# EAGLE design Weather Shield (EAGLE 6.5.0)
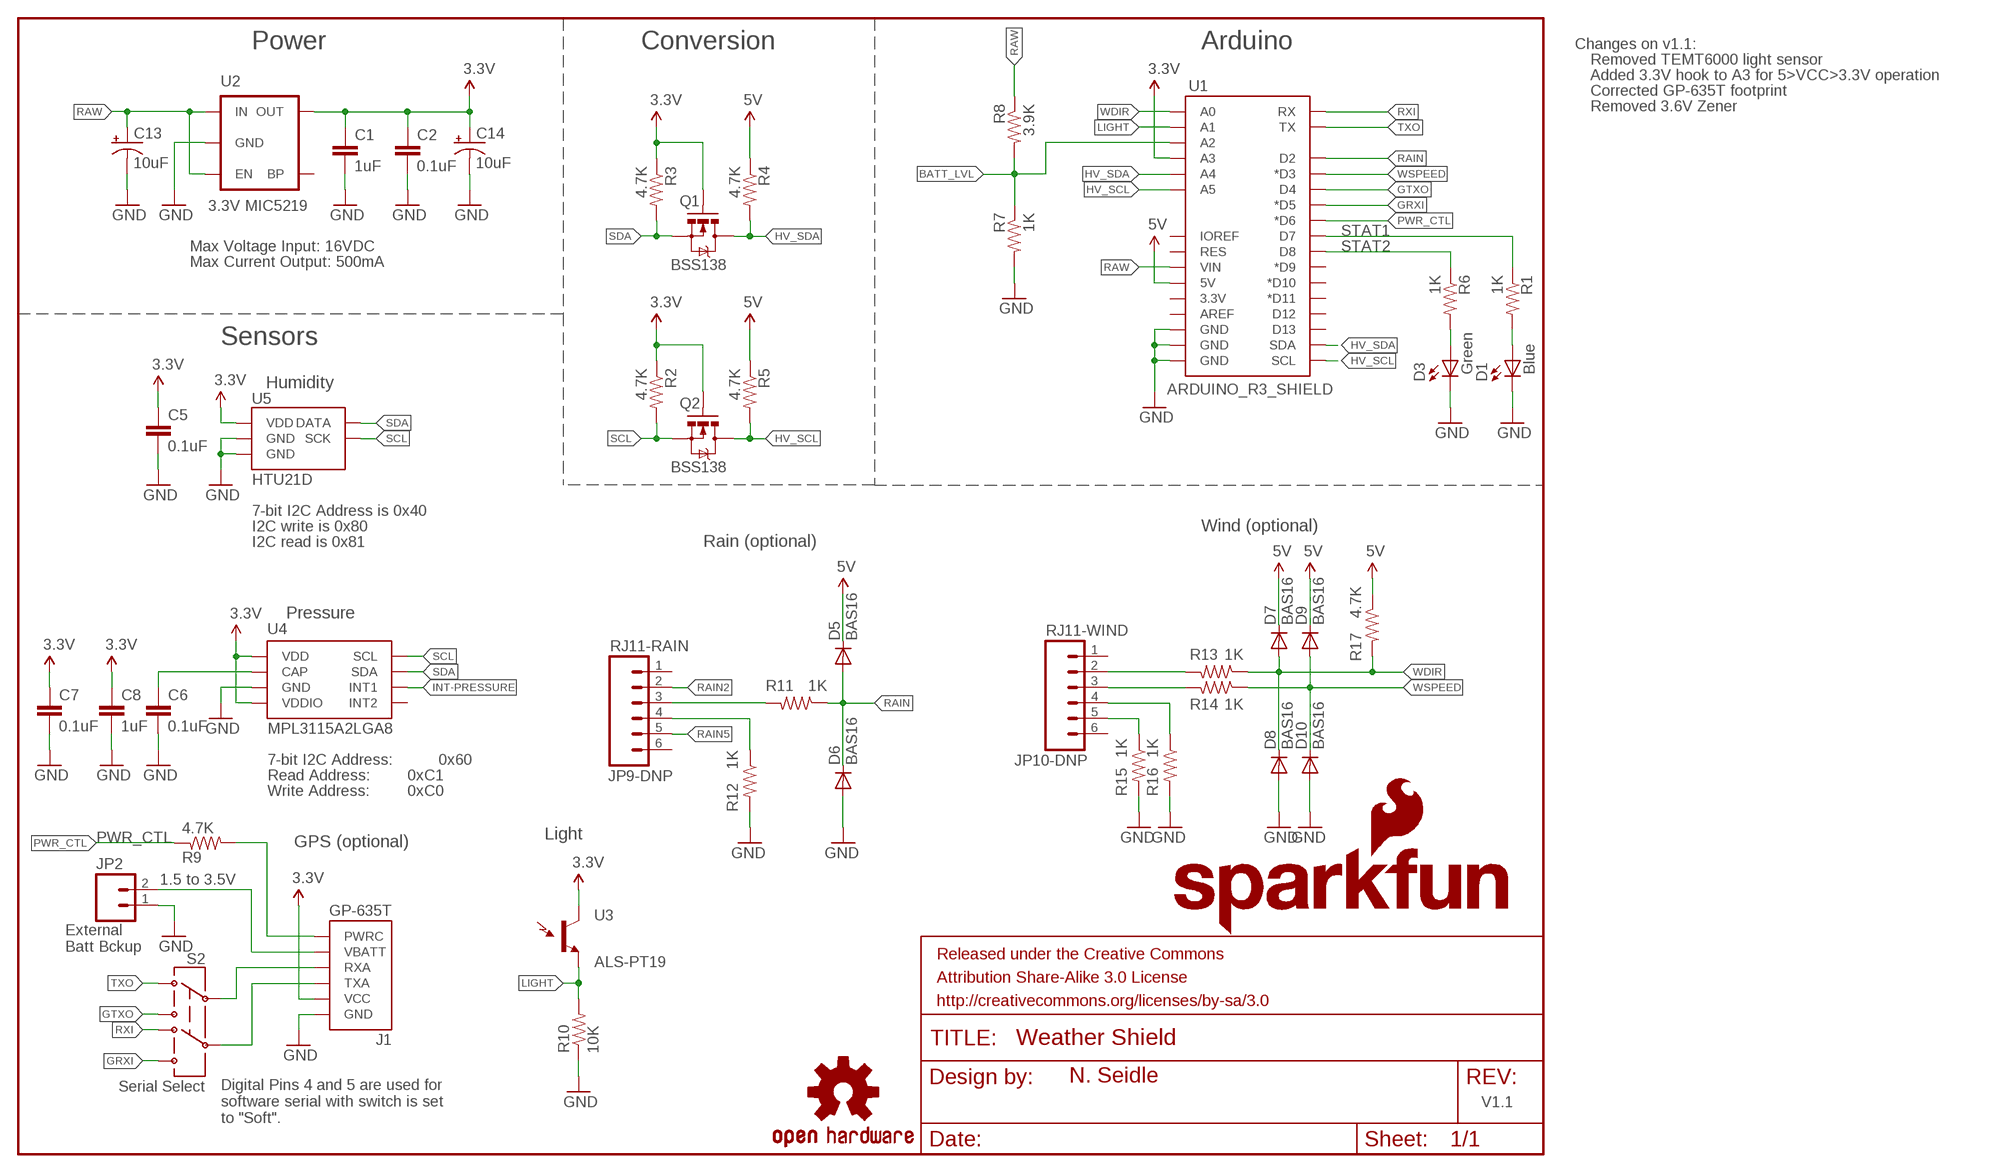
[diagram p0: schematic, sheet 1]

## Parts
C1  1uF  CAP0603-CAP  [0603-CAP]
C2  0.1uF  CAP0603-CAP  [0603-CAP]
C5  0.1uF  CAP0603-CAP  [0603-CAP]
C6  0.1uF  CAP0603-CAP  [0603-CAP]
C7  0.1uF  CAP0603-CAP  [0603-CAP]
C8  1uF  CAP0603-CAP  [0603-CAP]
C13  10uF  CAP_POL1206  [EIA3216]
C14  10uF  CAP_POL1206  [EIA3216]
D1  Blue  LED0603  [LED-0603]
D3  Green  LED0603  [LED-0603]
D5  BAS16  DIODESOD  [SOD-323]
D6  BAS16  DIODESOD  [SOD-323]
D7  BAS16  DIODESOD  [SOD-323]
D8  BAS16  DIODESOD  [SOD-323]
D9  BAS16  DIODESOD  [SOD-323]
D10  BAS16  DIODESOD  [SOD-323]
FRAME1  FRAME-LETTER  [CREATIVE_COMMONS]
J1  GP-635T  GP-635TSMD  [GP-635T]
JP2  External Batt Bckup  M02PTH  [1X02]
JP9-DNP  RJ11-RAIN  RJ11-6PTH  [RJ11-6]
JP10-DNP  RJ11-WIND  RJ11-6PTH  [RJ11-6]
LOGO1  OSHW-LOGOM  [OSHW-LOGO-M]
LOGO2  SFE_LOGO_NAME_FLAME.1_INCH  [SFE_LOGO_NAME_FLAME_.1]
Q1  BSS138  MOSFET-NCHANNELSMD  [SOT23-3]
Q2  BSS138  MOSFET-NCHANNELSMD  [SOT23-3]
R1  1K  RESISTOR0603-RES  [0603-RES]
R2  4.7K  RESISTOR0603-RES  [0603-RES]
R3  4.7K  RESISTOR0603-RES  [0603-RES]
R4  4.7K  RESISTOR0603-RES  [0603-RES]
R5  4.7K  RESISTOR0603-RES  [0603-RES]
R6  1K  RESISTOR0603-RES  [0603-RES]
R7  1K  RESISTOR0603-RES  [0603-RES]
R8  3.9K  RESISTOR0603-RES  [0603-RES]
R9  4.7K  RESISTOR0603-RES  [0603-RES]
R10  10K  RESISTOR0603-RES  [0603-RES]
R11  1K  RESISTOR0603-RES  [0603-RES]
R12  1K  RESISTOR0603-RES  [0603-RES]
R13  1K  RESISTOR0603-RES  [0603-RES]
R14  1K  RESISTOR0603-RES  [0603-RES]
R15  1K  RESISTOR0603-RES  [0603-RES]
R16  1K  RESISTOR0603-RES  [0603-RES]
R17  4.7K  RESISTOR0603-RES  [0603-RES]
S2  Serial Select  SWITCH-DPDTAYZ0202  [AYZ0202]
U1  ARDUINO_R3_SHIELD  [UNO_R3_SHIELD]
U2  3.3V MIC5219  V_REG_LDOSMD  [SOT23-5]
U3  ALS-PT19  LIGHTSENSORALS  [ALS-PT19]
U4  MPL3115A2LGA8  [LGA8]
U5  HTU21D  HTU21DSMD  [HTU21D]

## Nets
3.3V: C1.1 C2.1 C5.1 C7.1 C8.1 C14.A(+) J1.2(VCC) Q1.1(G) Q2.1(G) R2.1 R3.1 U1.A3 U2.5(OUT) U3.C(C1) U4.1(VDD) U4.4(VDDIO) U5.VDD
3V_PWR_CTL: J1.6(PWRC) R9.2
5V: D5.1(C) D7.1(C) D9.1(C) R4.1 R5.1 R17.1 U1.5V
BATT_LVL: R7.1 R8.2 U1.A2
GND [vcc]: C1.2 C2.2 C5.2 C6.2 C7.2 C8.2 C13.C(-) C14.C(-) D1.C D3.C D6.2(A) D8.2(A) D10.2(A) J1.1(GND) JP2.1 R7.2 R10.1 R12.2 R15.2 R16.2 U1.GND@0(GND) U1.GND@1(GND) U1.GND@2(GND) U2.2(GND) U4.3(GND) U5.7(GND) U5.GND
GPS-RX: J1.4(RXA) S2.2
GPS-TX: J1.3(TXA) S2.5
GRXI: S2.6 U1.D5(*D5)
GTXO: S2.3 U1.D4
HV_SCL: Q2.3(D) R5.2 U1.A5 U1.SCL
HV_SDA: Q1.3(D) R4.2 U1.A4 U1.SDA
INT-PRESSURE: U4.6(INT1)
LIGHT: R10.2 U1.A1 U3.E(E1)
N$1: JP10-DNP.3 R14.2
N$2: JP10-DNP.2 R13.2
N$3: D1.A R1.2
N$4: JP9-DNP.3 R11.2
N$5: C6.1 U4.2(CAP)
N$7: D3.A R6.2
N$11: JP9-DNP.4 R12.1
N$12: JP10-DNP.5 R15.1
N$13: JP10-DNP.4 R16.1
PWR_CTL: R9.1 U1.D6(*D6)
RAIN: D5.2(A) D6.1(C) R11.1 U1.D2
RAIN2: JP9-DNP.2
RAIN5: JP9-DNP.5
RAW [vcc]: C13.A(+) R8.1 U1.VIN U2.1(IN) U2.3(EN)
RXI: S2.4 U1.RX
SCL: Q2.2(S) R2.2 U4.8(SCL) U5.SCK
SDA: Q1.2(S) R3.2 U4.7(SDA) U5.DATA
STAT1: R1.1 U1.D7
STAT2: R6.1 U1.D8
TXO: S2.1 U1.TX
V_BATT: J1.5(VBATT) JP2.2
WDIR: D7.2(A) D8.1(C) R13.1 R17.2 U1.A0
WSPEED: D9.2(A) D10.1(C) R14.1 U1.D3(*D3)
Unconnected: JP9-DNP.1 JP9-DNP.6 JP10-DNP.1 JP10-DNP.6 U1.3.3V U1.AREF U1.D9(*D9) U1.D10(*D10) U1.D11(*D11) U1.D12 U1.D13 U1.IOREF U1.RES U2.4(BP) U4.5(INT2)

## Notes on the sheet
- Power | Conversion | Arduino | Changes on v1.1:
- Removed TEMT6000 light sensor
- Added 3.3V hook to A3 for 5>VCC>3.3V operation
- Corrected GP-635T footprint
- Removed 3.6V Zener
- Max Voltage Input: 16VDC
- Max Current Output: 500mA
- Sensors
- Humidity
- 7-bit I2C Address is 0x40
- I2C write is 0x80 | Wind (optional)
- I2C read is 0x81 | Rain (optional)
- Pressure
- 7-bit I2C Address: | 0x60
- Read Address: | 0xC1
- Write Address: | 0xC0
- Light
- GPS (optional)
- 1.5 to 3.5V
- External
  Batt Bckup
- N. Seidle
- V1.1
- Digital Pins 4 and 5 are used for 
  software serial with switch is set
  to "Soft".

## Library data of the parts
C1 C2 C5-C8 = SparkFun:CAP: Capacitor Standard 0603 ceramic capacitor, and 0.1" leaded capacitor.
C13 C14 = SparkFun-Passives:CAP_POL: Capacitor Polarized These are standard SMD and PTH capacitors. Normally 10uF, 47uF, and 100uF in electrolytic and tantalum varieties. Always verify the external diameter of the through hole cap, it varies with capacity, voltage, and manufacturer. The EIA devices should be standard.
D1 D3 = SparkFun:LED: LEDs Standard schematic elements and footprints for 5mm, 3mm, 1206, and 0603 sized LEDs. 5mm - Spark Fun Electronics SKU : COM-00529 (and others)
D5-D10 = SparkFun:DIODE: Diode These are standard reverse protection diodes and small signal diodes. SMA package can handle up to about 1A. SOD-323 can handle about 200mA. What the SOD-323 package when ordering, there are some mfgs out there that are 5-pin packages.
FRAME1 = SparkFun-Aesthetics:FRAME-LETTER: Schematic Frame Standard 8.5x11 US Letter frame
J1 = SparkFun-Sensors:GP-635T: Description: Footprint and symbol for the GP-635T GPS module. This is a very small, very accurate, low-cost GPS receiver. Footprint works with SKU GPS-00579. Use cable GPS-00574 or GPS-09123 to connect the receiver to this footprint+connector.
JP2 = SparkFun-Connectors:M02: Standard 2-pin 0.1" header. Use with - straight break away headers ( PRT-00116) - right angle break away headers (PRT-00553) - swiss pins (PRT-00743) - machine pins (PRT-00117) - female headers (PRT-00115) Molex polarized connector foot print use with: PRT-08233 with associated crimp pins and housings. 2.54_SCREWTERM for use with PRT-10571. 3.5mm Screw Terminal footprints for PRT-08084 5mm Screw Terminal footprints for use with PRT-08433
JP9-DNP JP10-DNP = SparkFun:RJ11-6: RJ11 Jack Simple 6 pin RJ11 jack. Commonly found on CAT3 devices and Microchip programmers. SKU: PRT-00132
LOGO1 = SparkFun-Aesthetics:OSHW-LOGO: Open Source Hardware Logo This logo indicates the piece of hardware it is found on incorporates a OSHW license and/or adheres to the definition of open source hardware found here: http://freedomdefined.org/OSHW
LOGO2 = SparkFun-Aesthetics:SFE_LOGO_NAME_FLAME: SFE Logo, name and flame This is the SparkFun full logo. The logo on the schematic will always be the same size; the package variant is the height of the flame part of the logo. Default layer for the logo on the board is tSilk.
Q1 Q2 = SparkFun:MOSFET-NCHANNEL
R1-R9 R11-R17 = SparkFun:RESISTOR: Resistor Basic schematic elements and footprints for 0603, 1206, and PTH resistors.
R10 = SparkFun-Passives:RESISTOR: Resistor Basic schematic elements and footprints for 0603, 1206, and PTH resistors.
S2 = SparkFun-Electromechanical:SWITCH-DPDT: DPDT Version of the COM-00597; PROD_ID: SWCH-08179; VALUE: DPDT
U1 = SparkFun-Boards:ARDUINO_R3_SHIELD: Shield form compatible with the Arduino Uno R3.
U2 = SparkFun:V_REG_LDO: Voltage Regulator LDO Standard 150mA LDO voltage regulator in SOT-23 layout. Micrel part MIC5205. BP (by-pass) pin is used to lower output noise with 470pF cap.
U3 = SparkFun-Sensors:LIGHTSENSOR: Ambient Light Sensor Simple light detection sensor. Output varies with light intensity input. Spark Fun Electronics SKU : COM-08348
U4 = SparkFun-Sensors:MPL3115A2: Altimeter/Pressure Sensor, I2C, 1.95V-3.6V supply, 50 to 110kPa
U5 = SparkFun-Sensors:HTU21D

## Net classes
0 Default: width 0.203 mm
1 vcc: width 0.203 mm

## Board
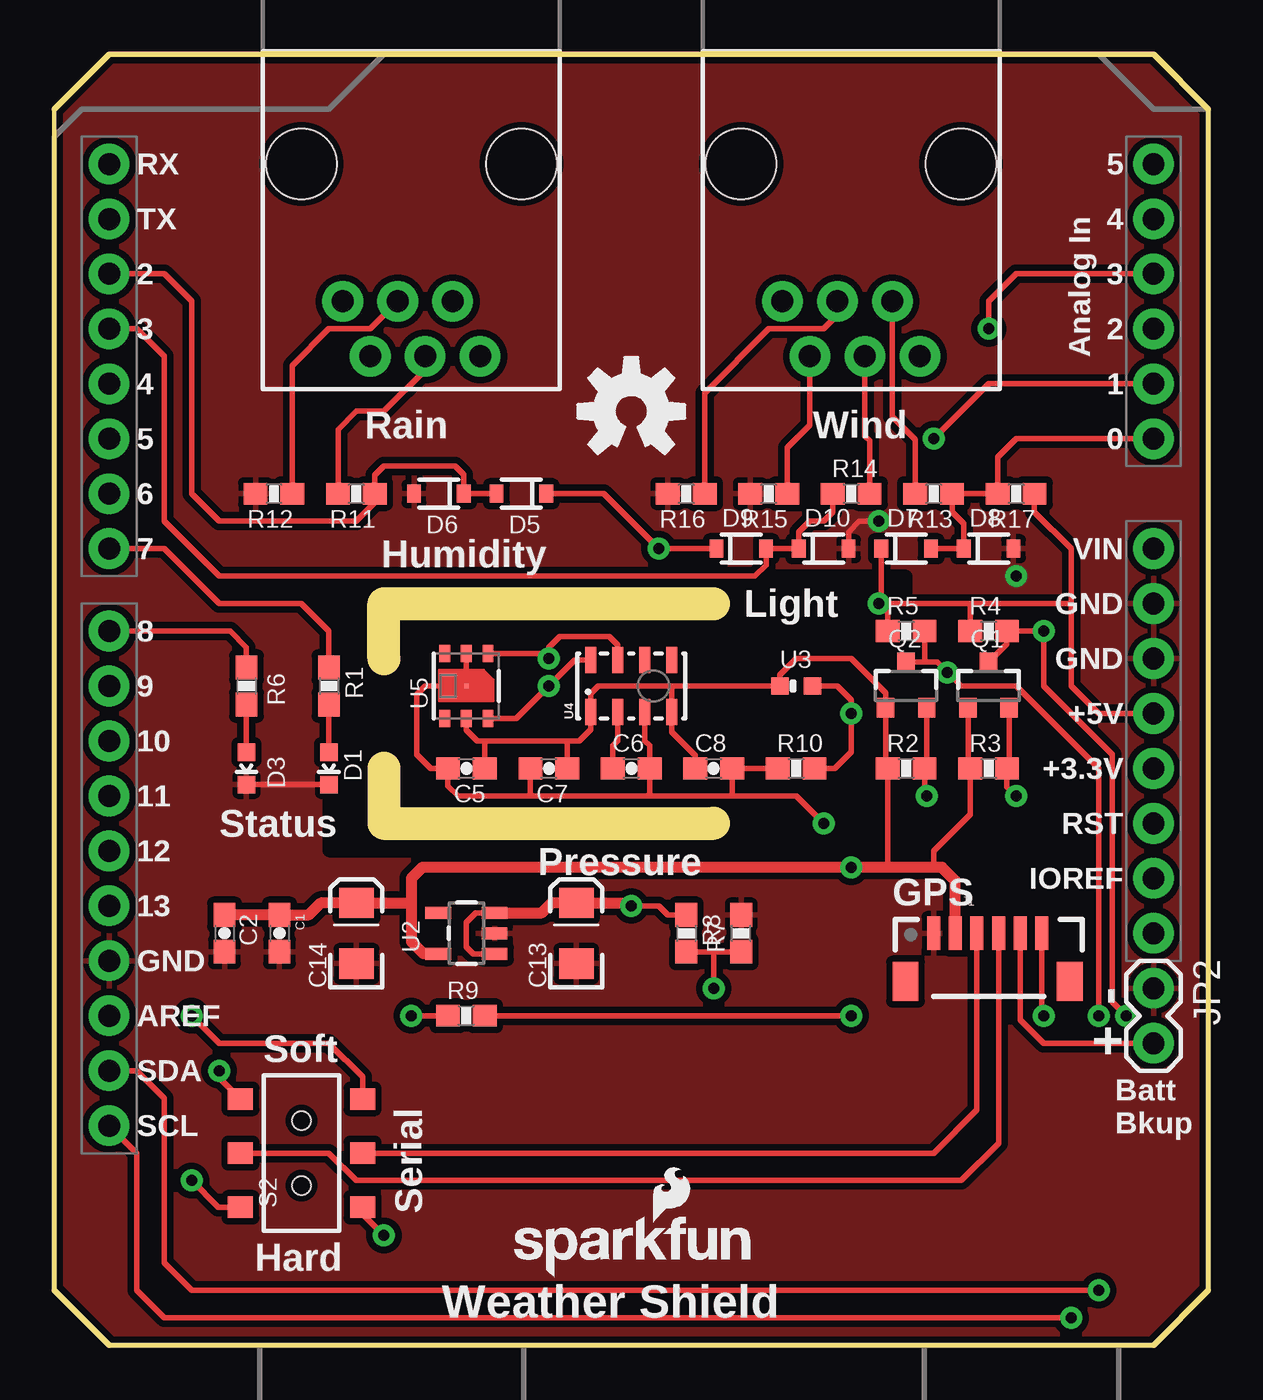
[diagram p1: board, top side]
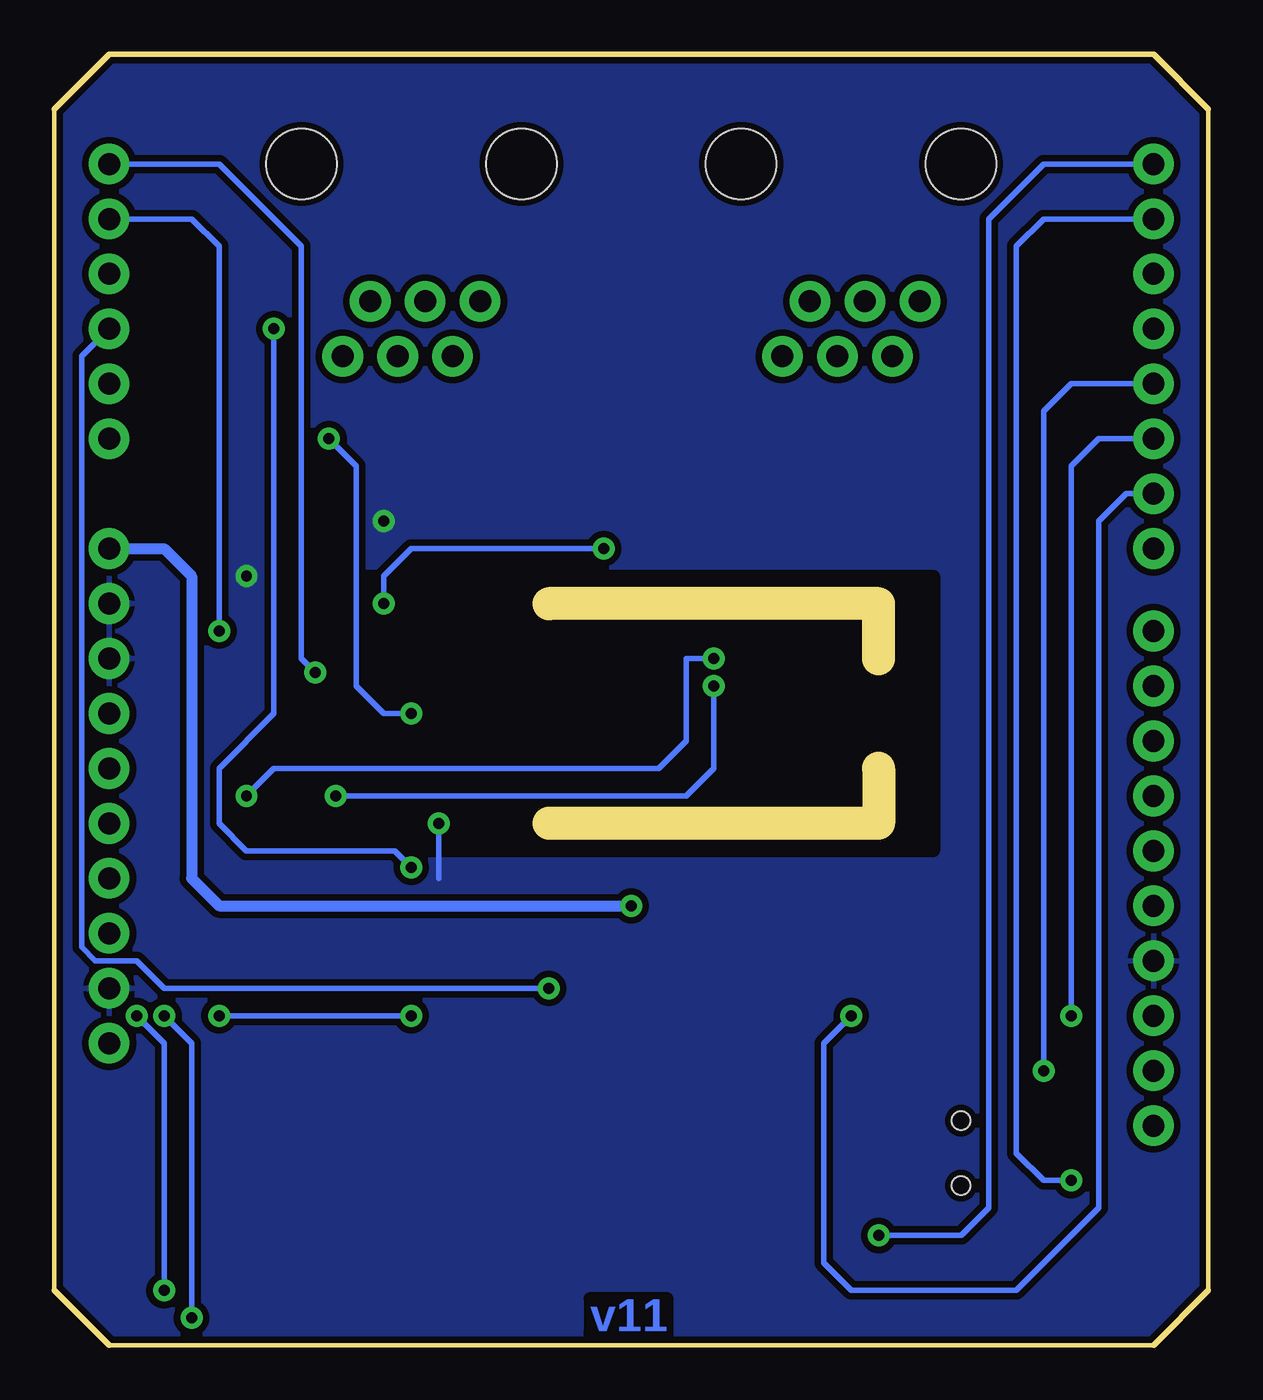
[diagram p2: board, bottom side, seen from below]

Size 53.34 x 59.69 mm. Coordinates in mm from the lower left corner, seen from the top.
Outline: 53.34,2.54 53.34,57.15 50.8,59.69 2.54,59.69 0,57.15 0,2.54 2.54,0 50.8,0 53.34,2.54
Copper layers (1*16): Top 0.035mm / dielectric 1.5mm / Bottom 0.035mm
Design rules "SparkFun": minimum track width 8mil, minimum drill 20mil, track to track 8mil, track to pad 8mil, pad to pad 8mil, via to via 8mil, smd to smd 8mil, copper to edge 10mil, drill to drill 8mil, minimum pad ring 12mil, minimum via ring 10mil, stop-mask expansion 4mil, vias tented up to drill 20mil, thermal gap 10mil
tRestrict: area 12.7,22.9 to 39.4,35.6
bRestrict: area 12.7,22.9 to 39.4,35.6
Milling: 4 lines

### Footprints (pad centres in the part's own frame; a part is rotated, then mirrored left to right if it is on the bottom)
0603-CAP = smd 1.1 x 1: 1 -0.85,0; 2 0.85,0
EIA3216 = smd 1.4 x 1.6: A 1.4,0; C -1.4,0
LED-0603 = smd 0.8 x 0.8: A 0,-0.75; C 0,0.75
SOD-323 = smd 0.63 x 0.83: 1 -1.15,0; 2 1.15,0
GP-635T = smd 0.6 x 1.55: 1 -2.54,1.27; 2 -1.54,1.27; 3 -0.54,1.27; 4 0.46,1.27; 5 1.46,1.27; 6 2.46,1.27 | smd 1.2 x 1.8: P$1 -3.84,-0.955; P$2 3.76,-0.955
1X02 = drill 1.016 pad 1.88: 1 0,0; 2 2.54,0
RJ11-6 = drill 1.016 pad 1.88: 1 1.905,8.89; 2 3.175,6.35; 3 4.445,8.89; 4 5.715,6.35; 5 6.985,8.89; 6 8.255,6.35 | hole 3.251: 0,0; 10.16,0
SOT23-3 = smd 0.8 x 0.9: 1 -0.95,-1; 2 0.95,-1; 3 0,1.1
0603-RES = smd 1.1 x 1: 1 -0.85,0; 2 0.85,0
AYZ0202 = smd 1 x 1.15: 1 -2.5,2.825; 2 0,2.825; 3 2.5,2.825; 4 -2.5,-2.825; 5 0,-2.825; 6 2.5,-2.825 | hole 0.85: 1.5,0; -1.5,0
UNO_R3_SHIELD = drill 1.016 pad 1.88: 3.3V 50.8,26.67; 5V 50.8,29.21; A0 50.8,41.91; A1 50.8,44.45; A2 50.8,46.99; A3 50.8,49.53; A4 50.8,52.07; A5 50.8,54.61; AREF 2.54,15.24; D2 2.54,49.53; D3 2.54,46.99; D4 2.54,44.45; D5 2.54,41.91; D6 2.54,39.37; D7 2.54,36.83; D8 2.54,33.02; D9 2.54,30.48; D10 2.54,27.94; D11 2.54,25.4; D12 2.54,22.86; D13 2.54,20.32; GND@0 50.8,31.75; GND@1 50.8,34.29; GND@2 2.54,17.78; IOREF 50.8,21.59; NC 50.8,19.05; RES 50.8,24.13; RX 2.54,54.61; SCL 2.54,10.16; SDA 2.54,12.7; TX 2.54,52.07; VIN 50.8,36.83
SOT23-5 = smd 0.55 x 1.2: 1 -0.95,-1.3; 2 0,-1.3; 3 0.95,-1.3; 4 0.95,1.3; 5 -0.95,1.3
ALS-PT19 = smd 0.8 x 0.8: C -0.75,0; E 0.75,0
LGA8 = smd 1.2 x 0.5: 1 -1.2,1.875; 2 -1.2,0.625; 3 -1.2,-0.625; 4 -1.2,-1.875; 5 1.2,-1.875; 6 1.2,-0.625; 7 1.2,0.625; 8 1.2,1.875
HTU21D = smd 0.2 x 0.2: 7 0,0 | smd 0.8 x 0.5: DATA 1.5,-1; GND 1.5,0; NC@1 -1.5,1; NC@6 1.5,1; SCK -1.5,-1; VDD -1.5,0

### Placement (x,y rotation side)
C1  10.41,19.05 270 top
C2  7.87,19.05 270 top
C5  19.05,26.67 180 top
C6  26.67,26.67 0 top
C7  22.86,26.67 180 top
C8  30.48,26.67 0 top
C13  24.13,19.05 90 top
C14  13.97,19.05 90 top
D1  12.7,26.67 180 top
D3  8.89,26.67 180 top
D5  21.59,39.37 180 top
D6  17.78,39.37 180 top
D7  39.37,36.83 0 top
D8  43.18,36.83 0 top
D9  31.75,36.83 0 top
D10  35.56,36.83 0 top
FRAME1  -8.89,-24.13 0 top  (outside the outline)
J1  43.18,17.78 0 top
JP2  50.8,16.51 270 top
JP9-DNP  21.59,54.61 180 top
JP10-DNP  41.91,54.61 180 top
LOGO1  26.67,43.18 0 top
LOGO2  20.83,3.05 0 top
Q1  43.18,30.48 0 top
Q2  39.37,30.48 0 top
R1  12.7,30.48 270 top
R2  39.37,26.67 0 top
R3  43.18,26.67 0 top
R4  43.18,33.02 0 top
R5  39.37,33.02 0 top
R6  8.89,30.48 270 top
R7  31.75,19.05 90 top
R8  29.21,19.05 270 top
R9  19.05,15.24 0 top
R10  34.29,26.67 0 top
R11  13.97,39.37 180 top
R12  10.16,39.37 180 top
R13  40.64,39.37 180 top
R14  36.83,39.37 0 top
R15  33.02,39.37 180 top
R16  29.21,39.37 180 top
R17  44.45,39.37 180 top
S2  11.43,8.89 90 top
U1  0,0 0 top
U2  19.05,19.05 90 top
U3  34.29,30.48 0 top
U4  26.67,30.48 90 top
U5  19.05,30.48 90 top

### Tracks (layer width: path | path; a pad name or v marks a point on that pad's centre or on a via)
3.3V  (via drill 0.51)
  Top 0.254: C7.1 23.71,27.9 | C8.1 29.63,27.27 28.55,28.35 U4.4 28.55,30.45 28.57,30.48 | 28.57,30.48 25.15,30.48 24.8,30.13 U4.1 24.8,28.48 24.26,27.94 23.75,27.94 23.71,27.9 | 28.57,30.48 U3.C 33.54,31 34.29,31.75 36.83,31.75 38.42,30.16 Q2.1 38.42,26.77 R2.1 38.52,22.31 38.73,22.1 | U1.A3 44.45,49.53 43.18,48.26 v43.18,46.99 | 18.2,22.14 18.16,22.1 | 40.64,22.1 40.64,22.86 42.33,24.55 R3.1 42.23,26.77 Q1.1 | U5.VDD 19.05,28.45 19.56,27.94 19.94,27.94 | 19.94,27.94 23.67,27.94 23.71,27.9 | C5.1 19.9,27.9 19.94,27.94
  Top 0.508: C2.1 C1.1 11.77,19.9 12.32,20.45 C14.A 16.38,20.45 16.51,20.32 | J1.2 41.64,21.48 41.02,22.1 40.64,22.1 38.73,22.1 v36.83,22.1 18.16,22.1 17.02,22.1 16.51,21.59 16.51,20.32 | 16.51,20.32 16.51,18.67 17.08,18.1 U2.5
  Bottom 0.254: v43.18,46.99 43.18,29.21 45.72,26.67 45.72,24.13 44.45,22.86 37.59,22.86 v36.83,22.1
3V_PWR_CTL  (via drill 0.51)
  Top 0.254: J1.6 45.64,15.32 v45.72,15.24 | R9.2 v36.83,15.24
  Bottom 0.254: v36.83,15.24 v45.72,15.24
5V  (via drill 0.51)
  Top 0.254: 42.33,32.98 R4.1 42.33,34.2 42.42,34.29 | D9.1 v27.94,36.83 25.4,39.37 D5.1 | 46.99,34.29 42.42,34.29 | 42.42,34.29 v38.1,34.29 | R17.1 45.3,38.52 46.99,36.83 46.99,34.29 | 46.99,34.29 46.99,30.48 48.26,29.21 U1.5V | D7.1 38.22,34.41 v38.1,34.29 | R5.1 38.52,33.87 v38.1,34.29
  Bottom 0.254: v27.94,36.83 36.83,36.83 38.1,35.56 v38.1,34.29
BATT_LVL  (via drill 0.51)
  Top 0.254: v30.48,16.51 30.48,18.2 | 30.48,18.2 R7.1 | 30.48,18.2 R8.2
  Bottom 0.254: U1.A2 52.07,45.72 52.07,18.41 51.44,17.78 49.53,17.78 48.26,16.51 v30.48,16.51
GND  (via drill 0.51)
  Top 0.254: U4.3 27.3,27.95 27.52,27.73 C6.2 27.52,25.49 27.43,25.4 | U5.GND U5.7 17.14,30.48 16.76,30.1 16.76,27.3 17.4,26.67 C5.2 18.2,25.87 18.67,25.4 22.1,25.4 | D10.2 36.71,37.6 37.21,38.1 v38.1,38.1 | 31.33,25.4 C8.2 R10.1 | D1.C D3.C | 22.1,25.4 27.43,25.4 | 27.43,25.4 31.33,25.4 | C7.2 22.01,25.49 22.1,25.4 | 31.33,25.4 34.29,25.4 v35.56,24.13
  Bottom 0.254: v35.56,24.13 35.56,21.59
  other vias: 44.45,35.56
  pour Top (isolate 0.305): 53.34,0 0,0 0,59.69 53.34,59.69
  pour Bottom (isolate 0.305): 53.34,0 0,0 0,59.69 53.34,59.69
GPS-RX
  Top 0.254: S2.2 12.7,8.89 13.97,7.62 41.91,7.62 43.64,9.35 J1.4
GPS-TX
  Top 0.254: J1.3 42.64,10.89 40.64,8.89 S2.5
GRXI  (via drill 0.51)
  Top 0.254: S2.6 14.26,12.41 12.7,13.97 7.62,13.97 v6.35,15.24
  Bottom 0.254: U1.D5 5.08,41.91 6.35,40.64 v6.35,15.24
GTXO  (via drill 0.51)
  Top 0.254: S2.3 7.62,12.38 v7.62,12.7
  Bottom 0.254: U1.D4 6.35,44.45 7.62,43.18 v7.62,12.7
HV_SCL  (via drill 0.51)
  Top 0.254: Q2.3 40.13,31.58 | 40.13,31.58 40.81,31.58 v41.27,31.11 41.91,30.48 44.45,30.48 48.26,26.67 v48.26,15.24 | R5.2 40.22,31.67 40.13,31.58 | v46.99,1.27 5.08,1.27 3.81,2.54 3.81,8.89 U1.SCL
  Bottom 0.254: U1.A5 45.72,54.61 41.91,50.8 41.91,31.75 v41.27,31.11 | v46.99,1.27 46.99,13.97 v48.26,15.24
HV_SDA  (via drill 0.51)
  Top 0.254: Q1.3 44.03,32.43 R4.2 v45.72,33.02 45.72,30.48 48.9,27.3 48.9,15.88 v49.53,15.24 | U1.SDA 3.81,12.7 5.08,11.43 5.08,3.81 6.35,2.54 v48.26,2.54
  Bottom 0.254: U1.A4 46.99,52.07 45.72,50.8 v45.72,33.02 | v48.26,2.54 48.26,13.97 v49.53,15.24
LIGHT  (via drill 0.51)
  Top 0.254: U1.A1 43.18,44.45 v40.64,41.91 | U3.E 36.2,30.48 36.83,29.84 v36.83,29.21 36.83,27.43 36.07,26.67 R10.2
  Bottom 0.254: v40.64,41.91 39.37,40.64 39.37,30.48 38.1,29.21 v36.83,29.21
N$1
  Top 0.254: JP10-DNP.3 37.47,42.04 37.68,41.82 R14.2
N$2
  Top 0.254: JP10-DNP.2 38.73,42.93 39.79,41.87 R13.2
N$3
  Top 0.254: R1.2 D1.A
N$4
  Top 0.254: JP9-DNP.3 17.14,45.09 15.24,43.18 13.97,43.18 13.12,42.33 R11.2
N$5
  Top 0.254: U4.2 26.05,27.95 25.82,27.73 C6.1
N$7
  Top 0.254: R6.2 D3.A
N$11
  Top 0.254: JP9-DNP.4 14.61,46.99 12.7,46.99 11.01,45.3 R12.1
N$12
  Top 0.254: JP10-DNP.5 34.92,42.55 33.87,41.49 R15.1
N$13
  Top 0.254: JP10-DNP.4 36.2,47.62 35.56,46.99 33.02,46.99 30.06,44.03 R16.1
PWR_CTL  (via drill 0.51)
  Top 0.254: v16.51,15.24 R9.1
  Bottom 0.254: U1.D6 3.81,39.37 5.08,38.1 5.08,6.35 8.89,2.54 16.51,2.54 17.78,3.81 17.78,13.97 v16.51,15.24
RAIN
  Top 0.254: U1.D2 5.08,49.53 6.35,48.26 6.35,39.37 7.62,38.1 13.97,38.1 14.82,38.95 R11.1 14.82,40.22 15.24,40.64 18.54,40.64 18.93,40.25 D6.1 D5.2
RAW  (via drill 0.51)
  Top 0.254: U2.1 19.36,18.1 19.05,18.41 19.05,19.56 19.49,20 U2.3 | v26.67,20.32 27.94,20.32 28.36,19.9 R8.1
  Top 0.508: U2.3 22.54,20 22.99,20.45 C13.A 26.54,20.45 v26.67,20.32
  Bottom 0.508: U1.VIN 48.26,36.83 46.99,35.56 46.99,21.59 45.72,20.32 v26.67,20.32
RXI  (via drill 0.51)
  Top 0.254: S2.4 14.26,6.07 v15.24,5.08
  Bottom 0.254: U1.RX 7.62,54.61 10.16,52.07 10.16,6.35 11.43,5.08 v15.24,5.08
SCL  (via drill 0.51)
  Top 0.254: U5.SCK 21.36,28.98 v22.86,30.48 24.06,31.68 U4.8 | Q2.2 40.32,26.77 R2.2 40.22,25.5 v40.32,25.4
  Bottom 0.254: v22.86,30.48 22.86,26.67 24.13,25.4 v40.32,25.4
SDA  (via drill 0.51)
  Top 0.254: U4.7 26.05,32.38 25.65,32.77 23.37,32.77 22.86,32.26 v22.86,31.75 22.63,31.98 U5.DATA | Q1.2 44.13,26.77 R3.2 44.03,25.82 v44.45,25.4
  Bottom 0.254: v22.86,31.75 24.13,31.75 24.13,27.94 25.4,26.67 43.18,26.67 v44.45,25.4
STAT1
  Top 0.254: U1.D7 5.08,36.83 7.62,34.29 11.43,34.29 12.7,33.02 R1.1
STAT2
  Top 0.254: U1.D8 8.13,33.02 8.89,32.26 R6.1
TXO  (via drill 0.51)
  Top 0.254: S2.1 7.58,6.39 v6.35,7.62
  Bottom 0.254: U1.TX 7.62,52.07 8.89,50.8 8.89,8.89 7.62,7.62 v6.35,7.62
V_BATT
  Top 0.254: J1.5 44.64,15.05 45.72,13.97 JP2.2
WDIR
  Top 0.254: D7.2 D8.1 42.03,37.98 41.49,38.52 R13.1 R17.2 43.6,41.06 44.45,41.91 U1.A0
WSPEED
  Top 0.254: U1.D3 3.81,46.99 5.08,45.72 5.08,38.1 7.62,35.56 32.38,35.56 32.9,36.08 D9.2 D10.1 34.41,37.59 34.92,38.1 35.56,38.1 35.98,38.52 R14.1

### Text on the board
Bottom: v11
tPlace: Rain | Wind | Humidity | Light | Status | Pressure | GPS | - | Soft | + | Batt / Bkup | Serial | Hard | Weather Shield
tValues: N. Seidle